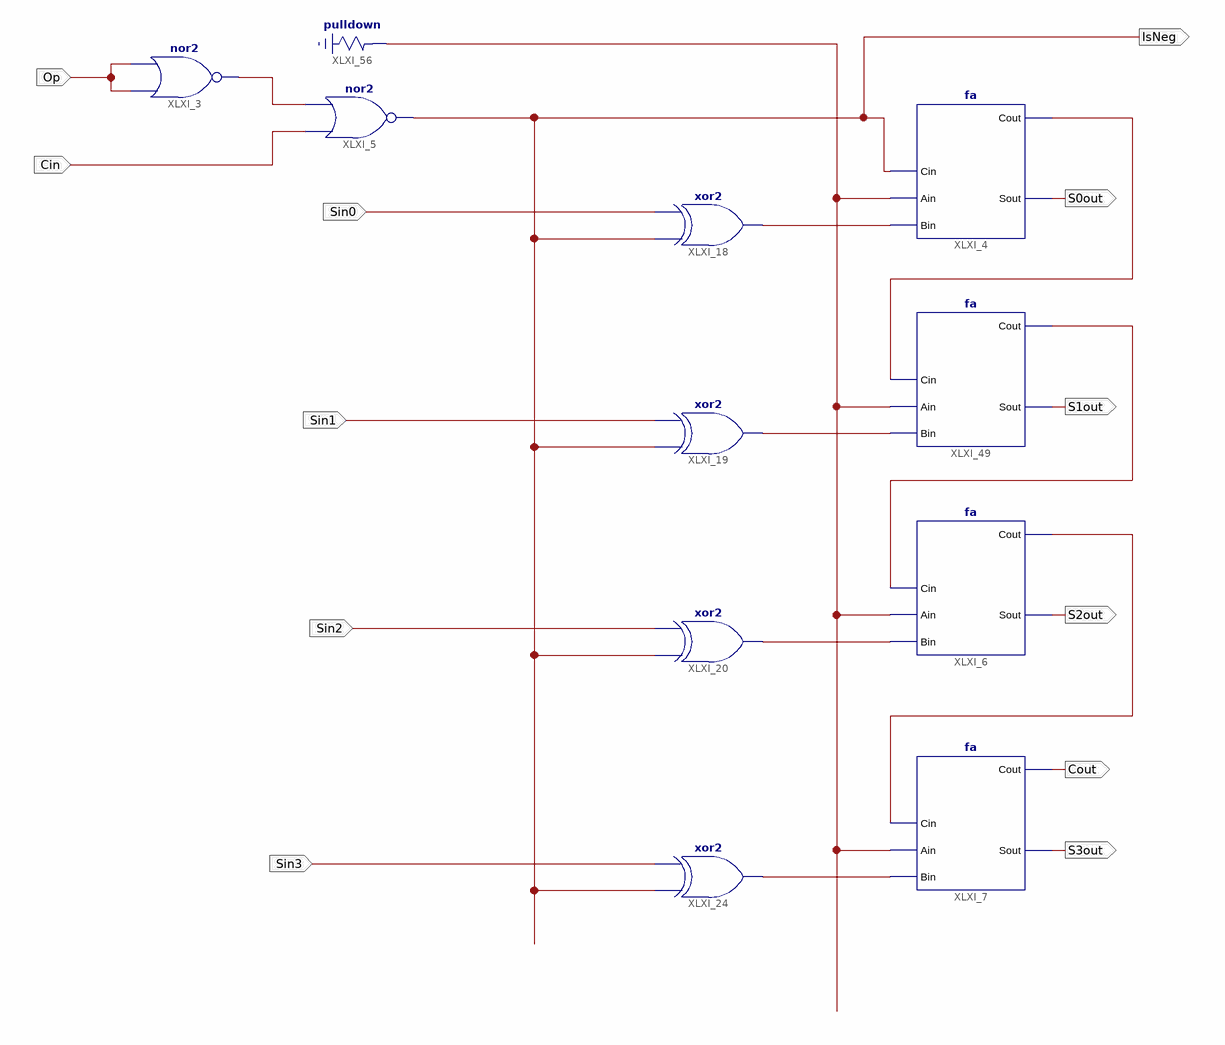
[diagram p0: schematic sheet 1]
// Xilinx ISE schematic TwosComp.sch (spartan3e) as structural Verilog: 11 symbols, 12 ports
module TwosComp (
  input  Op,
  input  Cin,
  input  Sin0,
  input  Sin1,
  input  Sin2,
  input  Sin3,
  output S0out,
  output S2out,
  output S3out,
  output Cout,
  output IsNeg,
  output S1out
);

  wire XLXN_22, XLXN_23, XLXN_24, XLXN_25, XLXN_56, XLXN_57, XLXN_58, XLXN_85, XLXN_182;

  nor XLXI_5 (IsNeg, Cin, XLXN_25);
  nor XLXI_3 (XLXN_25, Op, Op);
  fa XLXI_6 (.Cin(XLXN_23), .Cout(XLXN_24), .Ain(XLXN_182), .Bin(XLXN_58), .Sout(S2out));
  fa XLXI_7 (.Cin(XLXN_24), .Cout(Cout), .Ain(XLXN_182), .Bin(XLXN_85), .Sout(S3out));
  fa XLXI_49 (.Cin(XLXN_22), .Cout(XLXN_23), .Ain(XLXN_182), .Bin(XLXN_56), .Sout(S1out));
  fa XLXI_4 (.Cin(IsNeg), .Cout(XLXN_22), .Ain(XLXN_182), .Bin(XLXN_57), .Sout(S0out));
  xor XLXI_19 (XLXN_56, IsNeg, Sin1);
  xor XLXI_20 (XLXN_58, IsNeg, Sin2);
  xor XLXI_18 (XLXN_57, IsNeg, Sin0);
  xor XLXI_24 (XLXN_85, IsNeg, Sin3);
  \pulldown  XLXI_56 (.O(XLXN_182));
endmodule
